# EAGLE design TeensyBalanceBoard2.1 (EAGLE 8.2.0)
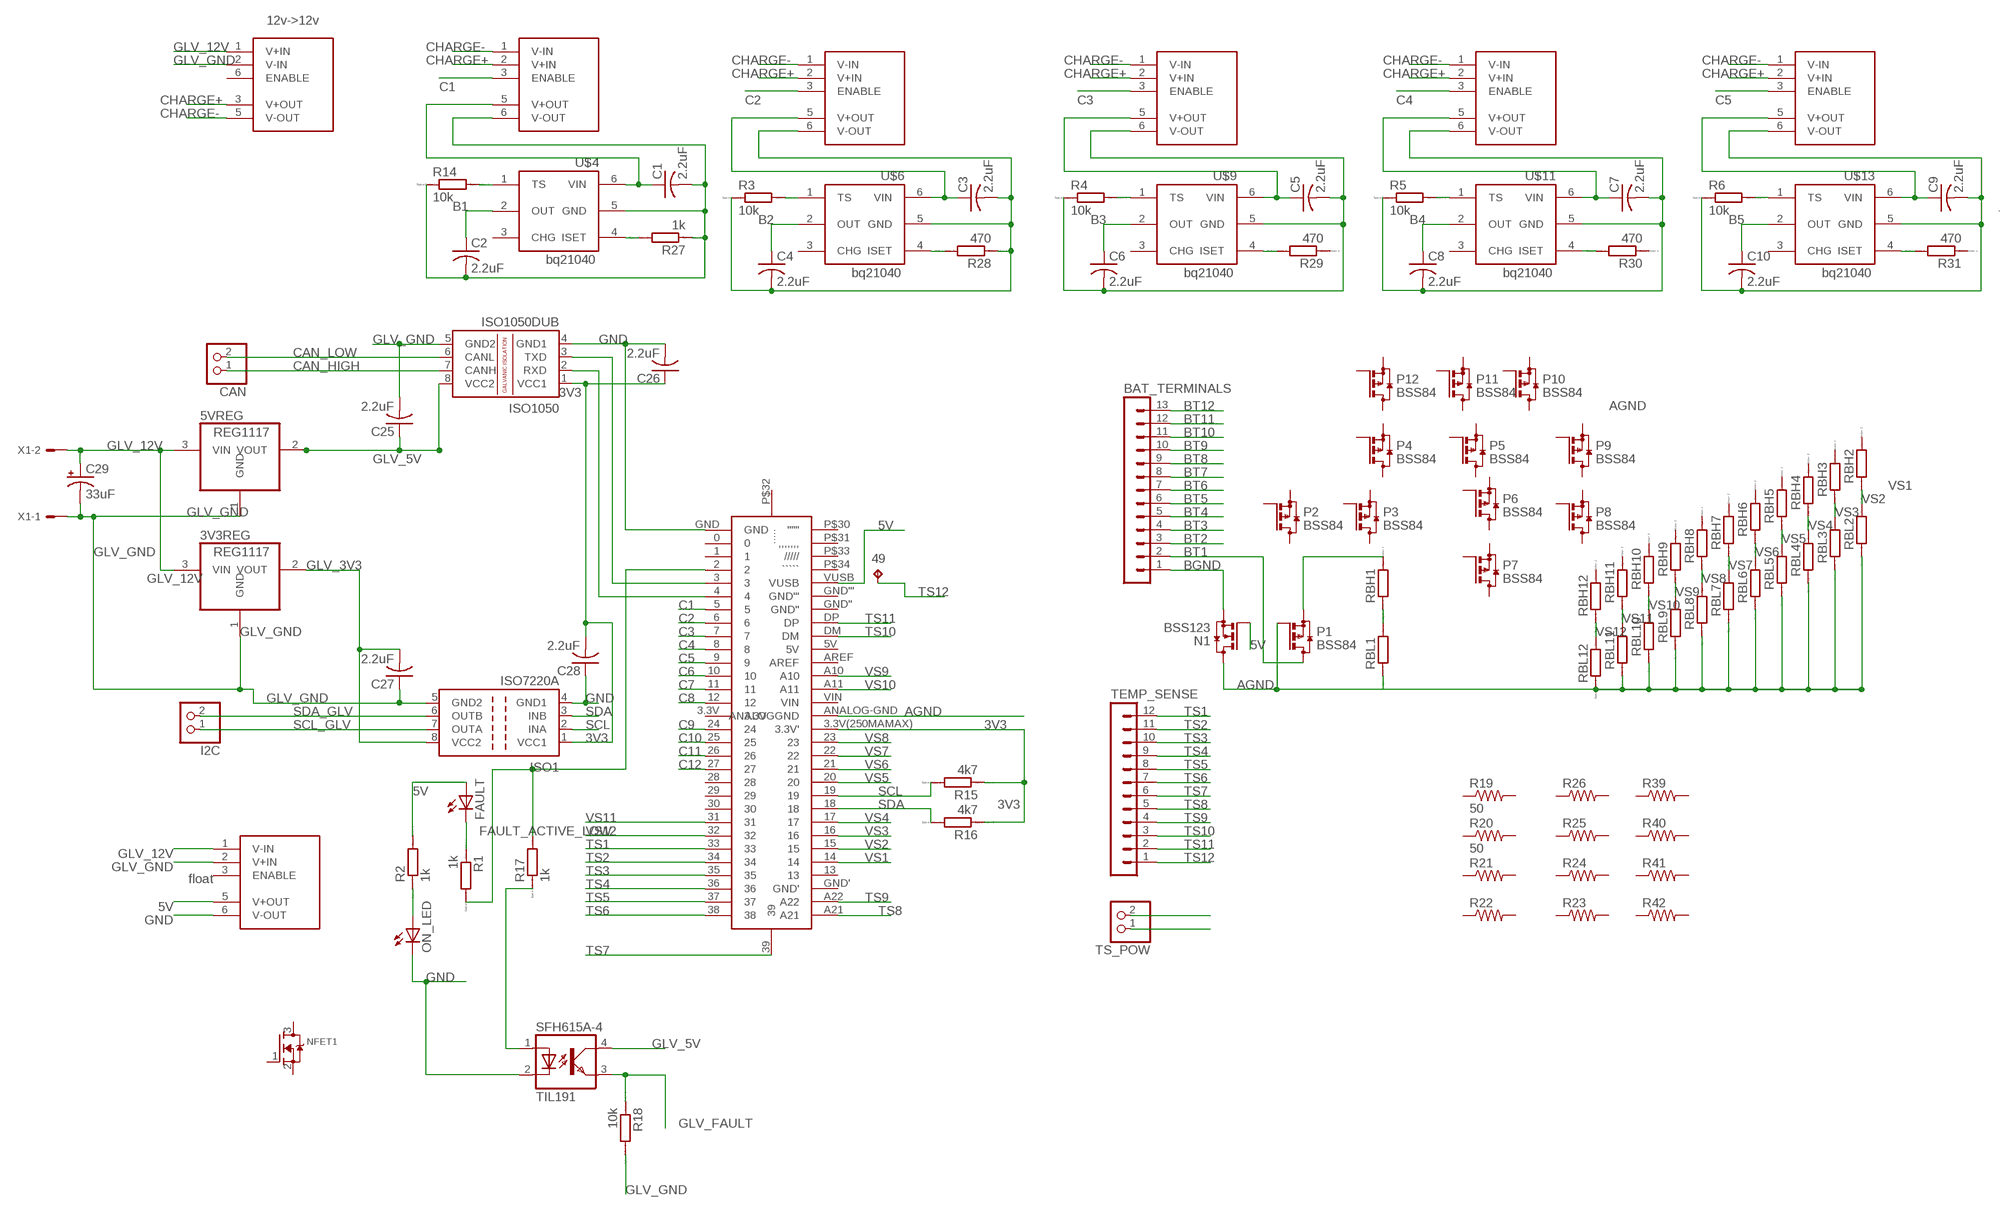
[diagram p0: schematic, sheet 1, part 1 of 2]
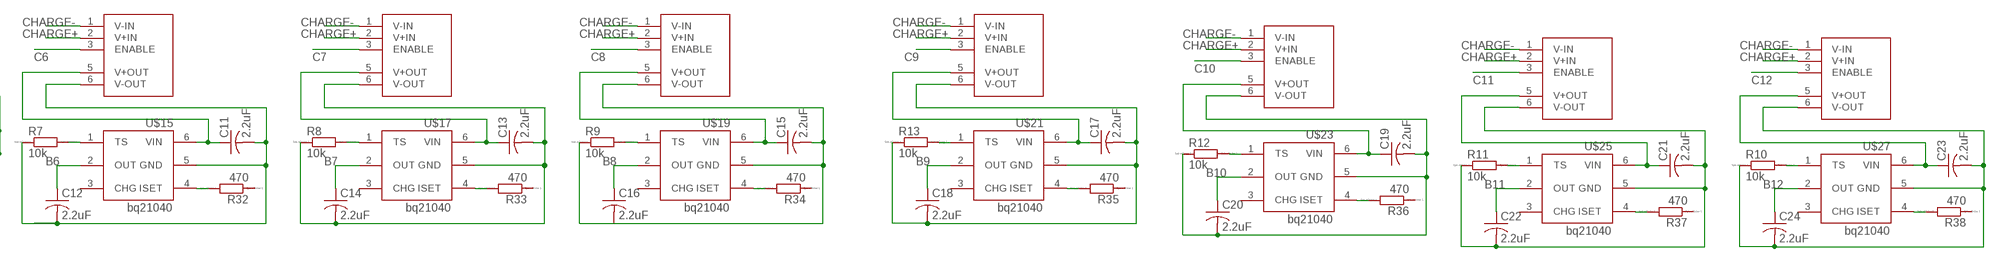
[diagram p1: schematic, sheet 1, part 2 of 2]

## Parts
3V3REG  REG1117  [SOT223]
5VREG  REG1117  [SOT223]
49  TPTP20SQ  [TP20SQ]
BAT_TERMINALS  MA13-1  [MA13-1]
C1  2.2uF  C-USC0603  [C0603]
C2  2.2uF  C-USC0603  [C0603]
C3  2.2uF  C-USC0603  [C0603]
C4  2.2uF  C-USC0603  [C0603]
C5  2.2uF  C-USC0603  [C0603]
C6  2.2uF  C-USC0603  [C0603]
C7  2.2uF  C-USC0603  [C0603]
C8  2.2uF  C-USC0603  [C0603]
C9  2.2uF  C-USC0603  [C0603]
C10  2.2uF  C-USC0603  [C0603]
C11  2.2uF  C-USC0603  [C0603]
C12  2.2uF  C-USC0603  [C0603]
C13  2.2uF  C-USC0603  [C0603]
C14  2.2uF  C-USC0603  [C0603]
C15  2.2uF  C-USC0603  [C0603]
C16  2.2uF  C-USC0603  [C0603]
C17  2.2uF  C-USC0603  [C0603]
C18  2.2uF  C-USC0603  [C0603]
C19  2.2uF  C-USC0603  [C0603]
C20  2.2uF  C-USC0603  [C0603]
C21  2.2uF  C-USC0603  [C0603]
C22  2.2uF  C-USC0603  [C0603]
C23  2.2uF  C-USC0603  [C0603]
C24  2.2uF  C-USC0603  [C0603]
C25  2.2uF  C-USC0603  [C0603]
C26  2.2uF  C-USC0603  [C0603]
C27  2.2uF  C-USC0603  [C0603]
C28  2.2uF  C-USC0603  [C0603]
C29  33uF  CPOL-USE3.5-10  [E3,5-10]
CAN  PINHD-1X2  [1X02]
FAULT  LEDSMT1206  [1206]
I2C  PINHD-1X2  [1X02]
ISO1  ISO7220A  [SO-08]
ISO1050  ISO1050DUB  [DUB-R-PDSO-G8]
N1  BSS123  [SOT23]
NFET1  MOSFET-NREFLOW  [SOT23]
ON_LED  LEDSMT1206  [1206]
P1  BSS84  [SOT23]
P2  BSS84  [SOT23]
P3  BSS84  [SOT23]
P4  BSS84  [SOT23]
P5  BSS84  [SOT23]
P6  BSS84  [SOT23]
P7  BSS84  [SOT23]
P8  BSS84  [SOT23]
P9  BSS84  [SOT23]
P10  BSS84  [SOT23]
P11  BSS84  [SOT23]
P12  BSS84  [SOT23]
R1  1k  RR0603  [R0603]
R2  1k  RR0603  [R0603]
R3  10k  RR0603  [R0603]
R4  10k  RR0603  [R0603]
R5  10k  RR0603  [R0603]
R6  10k  RR0603  [R0603]
R7  10k  RR0603  [R0603]
R8  10k  RR0603  [R0603]
R9  10k  RR0603  [R0603]
R10  10k  RR0603  [R0603]
R11  10k  RR0603  [R0603]
R12  10k  RR0603  [R0603]
R13  10k  RR0603  [R0603]
R14  10k  RR0603  [R0603]
R15  4k7  RR0603  [R0603]
R16  4k7  RR0603  [R0603]
R17  1k  RR0603  [R0603]
R18  10k  RR0603  [R0603]
R19  50  R-US_R1206W  [R1206W]
R20  50  R-US_R1206W  [R1206W]
R21  R-US_R1206W  [R1206W]
R22  R-US_R1206W  [R1206W]
R23  R-US_R1206W  [R1206W]
R24  R-US_R1206W  [R1206W]
R25  R-US_R1206W  [R1206W]
R26  R-US_R1206W  [R1206W]
R27  1k  RR0603  [R0603]
R28  470  RR0603  [R0603]
R29  470  RR0603  [R0603]
R30  470  RR0603  [R0603]
R31  470  RR0603  [R0603]
R32  470  RR0603  [R0603]
R33  470  RR0603  [R0603]
R34  470  RR0603  [R0603]
R35  470  RR0603  [R0603]
R36  470  RR0603  [R0603]
R37  470  RR0603  [R0603]
R38  470  RR0603  [R0603]
R39  R-US_R1206W  [R1206W]
R40  R-US_R1206W  [R1206W]
R41  R-US_R1206W  [R1206W]
R42  R-US_R1206W  [R1206W]
RBH1  RR0603  [R0603]
RBH2  RR0603  [R0603]
RBH3  RR0603  [R0603]
RBH4  RR0603  [R0603]
RBH5  RR0603  [R0603]
RBH6  RR0603  [R0603]
RBH7  RR0603  [R0603]
RBH8  RR0603  [R0603]
RBH9  RR0603  [R0603]
RBH10  RR0603  [R0603]
RBH11  RR0603  [R0603]
RBH12  RR0603  [R0603]
RBL1  RR0603  [R0603]
RBL2  RR0603  [R0603]
RBL3  RR0603  [R0603]
RBL4  RR0603  [R0603]
RBL5  RR0603  [R0603]
RBL6  RR0603  [R0603]
RBL7  RR0603  [R0603]
RBL8  RR0603  [R0603]
RBL9  RR0603  [R0603]
RBL10  RR0603  [R0603]
RBL11  RR0603  [R0603]
RBL12  RR0603  [R0603]
SFH615A-4  TIL191  [DIL04]
TEMP_SENSE  MA12-1  [MA12-1]
TS_POW  PINHD-1X2  [1X02]
U$1  TEENSY3.6  [TEENSY3.6]
U$2  EC4SAW-24S05N6-2411WI  [EC4SAW-24S05N]
U$3  EC4SAW-24S05N6-2411WI  [EC4SAW-24S05N]
U$4  10F200T  [SOT23-6]
U$5  EC4SAW-24S05N6-2411WI  [EC4SAW-24S05N]
U$6  10F200T  [SOT23-6]
U$7  EC4SAW-24S05N6-2411WI  [EC4SAW-24S05N]
U$8  PDQ30-Q24-S12-D  [PDQ30-Q24-S12-D]
U$9  10F200T  [SOT23-6]
U$10  EC4SAW-24S05N6-2411WI  [EC4SAW-24S05N]
U$11  10F200T  [SOT23-6]
U$12  EC4SAW-24S05N6-2411WI  [EC4SAW-24S05N]
U$13  10F200T  [SOT23-6]
U$14  EC4SAW-24S05N6-2411WI  [EC4SAW-24S05N]
U$15  10F200T  [SOT23-6]
U$16  EC4SAW-24S05N6-2411WI  [EC4SAW-24S05N]
U$17  10F200T  [SOT23-6]
U$18  EC4SAW-24S05N6-2411WI  [EC4SAW-24S05N]
U$19  10F200T  [SOT23-6]
U$20  EC4SAW-24S05N6-2411WI  [EC4SAW-24S05N]
U$21  10F200T  [SOT23-6]
U$22  EC4SAW-24S05N6-2411WI  [EC4SAW-24S05N]
U$23  10F200T  [SOT23-6]
U$24  EC4SAW-24S05N6-2411WI  [EC4SAW-24S05N]
U$25  10F200T  [SOT23-6]
U$26  EC4SAW-24S05N6-2411WI  [EC4SAW-24S05N]
U$27  10F200T  [SOT23-6]
X1  KK-156-2  [KK-156-2]

## Nets
3V3: C26.1 C28.2 ISO1.1(VCC1) ISO1050.1(VCC1) R15.1 R16.1 TS_POW.2 U$1.3.3V(250MAMAX)(3.3V')
5V [5vPower]: FAULT.A N1.1(G) R2.2 U$1.VUSB U$3.5(V+OUT)
AGND [5vPower]: C1.2 C2.2 N1.3(D) P1.1(G) R14.1 R27.1 RBL1.1 RBL2.1 RBL3.1 RBL4.1 RBL5.1 RBL6.1 RBL7.1 RBL8.1 RBL9.1 RBL10.1 RBL11.1 RBL12.1 TS_POW.1 U$1.ANALOG-GND(ANALOGGND) U$2.6(V-OUT) U$4.5(GND)
B1 [5vPower]: C2.1 C3.2 C4.2 R3.1 R28.1 U$4.2(OUT) U$5.6(V-OUT) U$6.5(GND)
B2 [5vPower]: C4.1 C5.2 C6.2 R4.1 U$6.2(OUT) U$7.6(V-OUT) U$9.5(GND)
B3 [5vPower]: C6.1 C7.2 C8.2 R5.1 U$9.2(OUT) U$10.6(V-OUT) U$11.5(GND)
B4 [5vPower]: C8.1 C9.2 C10.2 R6.1 U$11.2(OUT) U$12.6(V-OUT) U$13.5(GND)
B5 [5vPower]: C10.1 C11.2 C12.2 R7.1 U$13.2(OUT) U$14.6(V-OUT) U$15.5(GND)
B6 [5vPower]: C12.1 C13.2 C14.2 R8.1 U$15.2(OUT) U$16.6(V-OUT) U$17.5(GND)
B7 [5vPower]: C14.1 C15.2 C16.2 R9.1 U$17.2(OUT) U$18.6(V-OUT) U$19.5(GND)
B8 [5vPower]: C16.1 C17.2 C18.2 R13.1 U$19.2(OUT) U$20.6(V-OUT) U$21.5(GND)
B9 [5vPower]: C18.1 C19.2 C20.2 R12.1 U$21.2(OUT) U$22.6(V-OUT) U$23.5(GND)
B10 [5vPower]: C20.1 C21.2 C22.2 R11.1 U$23.2(OUT) U$24.6(V-OUT) U$25.5(GND)
B11 [5vPower]: C22.1 C23.2 C24.2 R10.1 U$25.2(OUT) U$26.6(V-OUT) U$27.5(GND)
B12 [5vPower]: C24.1 U$27.2(OUT)
BGND: BAT_TERMINALS.1 N1.2(S)
BT1: BAT_TERMINALS.2 P1.3(D)
BT2: BAT_TERMINALS.3
BT3: BAT_TERMINALS.4
BT4: BAT_TERMINALS.5
BT5: BAT_TERMINALS.6
BT6: BAT_TERMINALS.7
BT7: BAT_TERMINALS.8
BT8: BAT_TERMINALS.9
BT9: BAT_TERMINALS.10
BT10: BAT_TERMINALS.11
BT11: BAT_TERMINALS.12
BT12: BAT_TERMINALS.13
C1: U$1.5 U$2.3(ENABLE)
C2: U$1.6 U$5.3(ENABLE)
C3: U$1.7 U$7.3(ENABLE)
C4: U$1.8 U$10.3(ENABLE)
C5: U$1.9 U$12.3(ENABLE)
C6: U$1.10 U$14.3(ENABLE)
C7: U$1.11 U$16.3(ENABLE)
C8: U$1.12 U$18.3(ENABLE)
C9: U$1.24 U$20.3(ENABLE)
C10: U$1.25 U$22.3(ENABLE)
C11: U$1.26 U$24.3(ENABLE)
C12: U$1.27 U$26.3(ENABLE)
CAN_HIGH: CAN.1 ISO1050.7(CANH)
CAN_LOW: CAN.2 ISO1050.6(CANL)
CHARGE+ [12vPower]: U$2.2(V+IN) U$5.2(V+IN) U$7.2(V+IN) U$8.3(V+OUT) U$10.2(V+IN) U$12.2(V+IN) U$14.2(V+IN) U$16.2(V+IN) U$18.2(V+IN) U$20.2(V+IN) U$22.2(V+IN) U$24.2(V+IN) U$26.2(V+IN)
CHARGE- [12vPower]: U$2.1(V-IN) U$5.1(V-IN) U$7.1(V-IN) U$8.5(V-OUT) U$10.1(V-IN) U$12.1(V-IN) U$14.1(V-IN) U$16.1(V-IN) U$18.1(V-IN) U$20.1(V-IN) U$22.1(V-IN) U$24.1(V-IN) U$26.1(V-IN)
FAULT_ACTIVE_LOW: R1.2 R17.2 U$1.2
GLV_3V3: C27.2 ISO1.8(VCC2)
GLV_5V: 5VREG.2(VOUT) C25.1 ISO1050.8(VCC2) SFH615A-4.4(COL)
GLV_12V [12vPower]: 3V3REG.3(VIN) 5VREG.3(VIN) C29.+ U$3.1(V-IN) U$8.1(V+IN) X1.2
GLV_FAULT: R18.1 SFH615A-4.3(EMIT)
GLV_GND [12vPower]: 3V3REG.1(GND) 5VREG.1(GND) C25.2 C27.1 C29.- ISO1050.5(GND2) U$3.2(V+IN) U$8.2(V-IN) X1.1
GND [12vPower]: C26.2 C28.1 ISO1050.4(GND1) ON_LED.C SFH615A-4.2(C) U$1.GND U$3.6(V-OUT)
N$1 [5vPower]: C1.1 U$2.5(V+OUT) U$4.6(VIN)
N$2: R17.1 SFH615A-4.1(A)
N$3: ISO1050.3(TXD) U$1.3
N$4: ISO1050.2(RXD) U$1.4
N$5 [5vPower]: C3.1 U$5.5(V+OUT) U$6.6(VIN)
N$6: ON_LED.A R2.1
N$7: FAULT.C R1.1
N$8: R27.2 U$4.4(ISET)
N$9: R28.2 U$6.4(ISET)
N$10 [5vPower]: C5.1 U$7.5(V+OUT) U$9.6(VIN)
N$11: R29.2 U$9.4(ISET)
N$12 [5vPower]: C7.1 U$10.5(V+OUT) U$11.6(VIN)
N$13: R30.2 U$11.4(ISET)
N$14 [5vPower]: C9.1 U$12.5(V+OUT) U$13.6(VIN)
N$15: R31.2 U$13.4(ISET)
N$16 [5vPower]: C11.1 U$14.5(V+OUT) U$15.6(VIN)
N$17: R32.2 U$15.4(ISET)
N$18 [5vPower]: C13.1 U$16.5(V+OUT) U$17.6(VIN)
N$19: R33.2 U$17.4(ISET)
N$20 [5vPower]: C15.1 U$18.5(V+OUT) U$19.6(VIN)
N$21: R34.2 U$19.4(ISET)
N$22 [5vPower]: C17.1 U$20.5(V+OUT) U$21.6(VIN)
N$23: R35.2 U$21.4(ISET)
N$24 [5vPower]: C19.1 U$22.5(V+OUT) U$23.6(VIN)
N$25: R36.2 U$23.4(ISET)
N$26 [5vPower]: C21.1 U$24.5(V+OUT) U$25.6(VIN)
N$27: R37.2 U$25.4(ISET)
N$28 [5vPower]: C23.1 U$26.5(V+OUT) U$27.6(VIN)
N$29: R38.2 U$27.4(ISET)
N$30: R3.2 U$6.1(TS)
N$31: R13.2 U$21.1(TS)
N$32: R12.2 U$23.1(TS)
N$33: R11.2 U$25.1(TS)
N$34: R10.2 U$27.1(TS)
N$35: R9.2 U$19.1(TS)
N$36: R8.2 U$17.1(TS)
N$37: R7.2 U$15.1(TS)
N$38: R6.2 U$13.1(TS)
N$39: R5.2 U$11.1(TS)
N$40: R4.2 U$9.1(TS)
N$41: R14.2 U$4.1(TS)
N$47: P1.2(S) RBH1.2
SCL: ISO1.2(INA) R15.2 U$1.19
SCL_GLV: I2C.1 ISO1.7(OUTA)
SDA: ISO1.3(INB) R16.2 U$1.18
SDA_GLV: I2C.2 ISO1.6(OUTB)
TS1: TEMP_SENSE.12 U$1.33
TS2: TEMP_SENSE.11 U$1.34
TS3: TEMP_SENSE.10 U$1.35
TS4: TEMP_SENSE.9 U$1.36
TS5: TEMP_SENSE.8 U$1.37
TS6: TEMP_SENSE.7 U$1.38
TS7: TEMP_SENSE.6 U$1.39
TS8: TEMP_SENSE.5 U$1.A21
TS9: TEMP_SENSE.4 U$1.A22
TS10: TEMP_SENSE.3 U$1.DM
TS11: TEMP_SENSE.2 U$1.DP
TS12: 49.TP TEMP_SENSE.1
VS1: RBH1.1 RBL1.2 U$1.14
VS2: RBH2.1 RBL2.2 U$1.15
VS3: RBH3.1 RBL3.2 U$1.16
VS4: RBH4.1 RBL4.2 U$1.17
VS5: RBH5.1 RBL5.2 U$1.20
VS6: RBH6.1 RBL6.2 U$1.21
VS7: RBH7.1 RBL7.2 U$1.22
VS8: RBH8.1 RBL8.2 U$1.23
VS9: RBH9.1 RBL9.2 U$1.A10
VS10: RBH10.1 RBL10.2 U$1.A11
VS11: RBH11.1 RBL11.2 U$1.31
VS12: RBH12.1 RBL12.2 U$1.32
Unconnected: 3V3REG.2(VOUT) NFET1.1(G) NFET1.2(S) NFET1.3(D) P2.1(G) P2.2(S) P2.3(D) P3.1(G) P3.2(S) P3.3(D) P4.1(G) P4.2(S) P4.3(D) P5.1(G) P5.2(S) P5.3(D) P6.1(G) P6.2(S) P6.3(D) P7.1(G) P7.2(S) P7.3(D) P8.1(G) P8.2(S) P8.3(D) P9.1(G) P9.2(S) P9.3(D) P10.1(G) P10.2(S) P10.3(D) P11.1(G) P11.2(S) P11.3(D) P12.1(G) P12.2(S) P12.3(D) R18.2 R19.1 R19.2 R20.1 R20.2 R21.1 R21.2 R22.1 R22.2 R23.1 R23.2 R24.1 R24.2 R25.1 R25.2 R26.1 R26.2 R29.1 R30.1 R31.1 R32.1 R33.1 R34.1 R35.1 R36.1 R37.1 R38.1 R39.1 R39.2 R40.1 R40.2 R41.1 R41.2 R42.1 R42.2 RBH2.2 RBH3.2 RBH4.2 RBH5.2 RBH6.2 RBH7.2 RBH8.2 RBH9.2 RBH10.2 RBH11.2 RBH12.2 U$1.0 U$1.1 U$1.3.3V U$1.5V U$1.13 U$1.28 U$1.29 U$1.30 U$1.AREF U$1.GND' U$1.GND'' U$1.GND''' U$1.P$30('''''') U$1.P$31(,,,,,,,) U$1.P$32(.....) U$1.P$33(/////) U$1.P$34(`````) U$1.VIN U$3.3(ENABLE) U$4.3(CHG) U$6.3(CHG) U$8.6(ENABLE) U$9.3(CHG) U$11.3(CHG) U$13.3(CHG) U$15.3(CHG) U$17.3(CHG) U$19.3(CHG) U$21.3(CHG) U$23.3(CHG) U$25.3(CHG) U$27.3(CHG)

## Notes on the sheet
- 12v->12v
- float

## Power pins joined to a net without a drawn wire
GND1: ISO1.4(GND1)
GND2: ISO1.5(GND2)

## Library data of the parts
3V3REG 5VREG = burr-brown:REG1117: 800mA and 1A Low Dropout (LDO) Positive Regulator 1.8V, 2.5V, 2.85V, 3.3V, 5V, and Adj; MPN: REG1117; OC_FARNELL: 1097566; OC_NEWARK: 14P6981
49 = testpad:TP: Test pad
BAT_TERMINALS = con-lstb:MA13-1: PIN HEADER; OC_FARNELL: unknown; OC_NEWARK: unknown
C1-C28 = adafruit:C-US: CAPACITOR, American symbol
C29 = adafruit:CPOL-US: POLARIZED CAPACITOR, American symbol
CAN I2C TS_POW = pinhead:PINHD-1X2: PIN HEADER
FAULT ON_LED = led:LED: LED OSRAM: - CHIPLED LG R971, LG N971, LY N971, LG Q971, LY Q971, LO R971, LY R971 LH N974, LH R974 LS Q976, LO Q976, LY Q976 LO Q996 - Hyper CHIPLED LW Q18S LB Q993, LB Q99A, LB R99A - SideLED LS A670, LO A670, LY A670, LG A670, LP A670 LB A673, LV A673, LT A673, LW A673 LH A674 LY A675 LS A676, LA A676, LO A676, LY A676, LW A676 LS A679, LY A679, LG A679 - Hyper Micro SIDELED® LS Y876, LA Y876, LO Y876, LY Y876 LT Y87S - SmartLED LW L88C, LW L88S LB L89C, LB L89S, LG L890 LS L89K, LO L89K, LY L89K LS L896, LA L896, LO L896, LY L896 - TOPLED LS T670, LO T670, LY T670, LG T670, LP T670 LSG T670, LSP T670, LSY T670, LOP T670, LYG T670 LG T671, LOG T671, LSG T671 LB T673, LV T673, LT T673, LW T673 LH T674 LS T676, LA T676, LO T676, LY T676, LB T676, LH T676, LSB T676, LW T676 LB T67C, LV T67C, LT T67C, LS T67K, LO T67K, LY T67K, LW E67C LS E67B, LA E67B, LO E67B, LY E67B, LB E67C, LV E67C, LT E67C LW T67C LS T679, LY T679, LG T679 LS T770, LO T770, LY T770, LG T770, LP T770 LB T773, LV T773, LT T773, LW T773 LH T774 LS E675, LA E675, LY E675, LS T675 LS T776, LA T776, LO T776, LY T776, LB T776 LHGB T686 LT T68C, LB T68C - Hyper Mini TOPLED® LB M676 - Mini TOPLED Santana® LG M470 LS M47K, LO M47K, LY M47K Source: http://www.osram.convergy.de LUXEON: - LUMILED® LXK2-PW12-R00, LXK2-PW12-S00, LXK2-PW14-U00, LXK2-PW14-V00 LXK2-PM12-R00, LXK2-PM12-S00, LXK2-PM14-U00 LXK2-PE12-Q00, LXK2-PE12-R00, LXK2-PE12-S00, LXK2-PE14-T00, LXK2-PE14-U00 LXK2-PB12-K00, LXK2-PB12-L00, LXK2-PB12-M00, LXK2-PB14-N00, LXK2-PB14-P00, LXK2-PB14-Q00 LXK2-PR12-L00, LXK2-PR12-M00, LXK2-PR14-Q00, LXK2-PR14-R00 LXK2-PD12-Q00, LXK2-PD12-R00, LXK2-PD12-S00 LXK2-PH12-R00, LXK2-PH12-S00 LXK2-PL12-P00, LXK2-PL12-Q00, LXK2-PL12-R00 Source: www.luxeon.com KINGBRIGHT: KA-3528ASYC Source: www.kingbright.com
ISO1 = texas:ISO7220: DUAL DIGITAL ISOLATORS Source: http://focus.ti.com/lit/ds/symlink/iso7221a.pdf; MPN: ISO7220AD; OC_FARNELL: 1390649; OC_NEWARK: 48M0666
ISO1050 = texas:ISO1050: ISOLATED CAN TRANSCEIVER Source: http://focus.ti.com/lit/ds/symlink/iso1050.pdf; MPN: ISO1050DUBR; OC_FARNELL: 1755712; OC_NEWARK: 14R9899
N1 = transistor-small-signal:BSS123: N-CHANNEL MOS FET
NFET1 = adafruit:MOSFET-N: N-Channel Mosfet 2N7002E - 60V 260mA SOT23 [Digikey: 2N7002ET1GOSTR-ND] - REEL BSH103 - 30V 850mA SOT23 [Digikey: 568-5013-1-ND]
P1-P12 = transistor-small-signal:BSS84: P-CHANNEL MOS FET
R1-R18 R27-R38 RBH1-RBH12 RBL1-RBL12 = eagle-ltspice:R: RESISTOR, European symbol; SPICEMODEL: NONE; SPICEPREFIX: R
R19-R26 R39-R42 = adafruit:R-US_: RESISTOR, American symbol
SFH615A-4 = optocoupler:TIL191: TEXAS INSTRUMENTS OPTO COUPLER; OC_FARNELL: 1683363; OC_NEWARK: unknown
TEMP_SENSE = con-lstb:MA12-1: PIN HEADER; OC_FARNELL: unknown; OC_NEWARK: unknown
U$1 = Teensy36:TEENSY3.6
U$2 U$3 U$5 U$7 U$10 U$12 U$14 U$16 U$18 U$20 U$22 U$24 U$26 = Teensy36:EC4SAW-24S05N
U$4 U$6 U$9 U$11 U$13 U$15 U$17 U$19 U$21 U$23 U$25 U$27 = adafruit:10F200T: PIC10F200/202/204/206 Ultra-small 8-bit PIC micros in SOT-23-6 and SOIC
U$8 = Teensy36:PDQ30-Q24-S12-D
X1 = con-molex:KK-156-2: KK 156 HEADER Source: http://www.molex.com/pdm_docs/sd/026604100_sd.pdf; OC_FARNELL: unknown; OC_NEWARK: unknown

## Net classes
0 default: width 0.203 mm
1 12vPower: width 1.016 mm
2 5vPower: width 0.508 mm

## Board
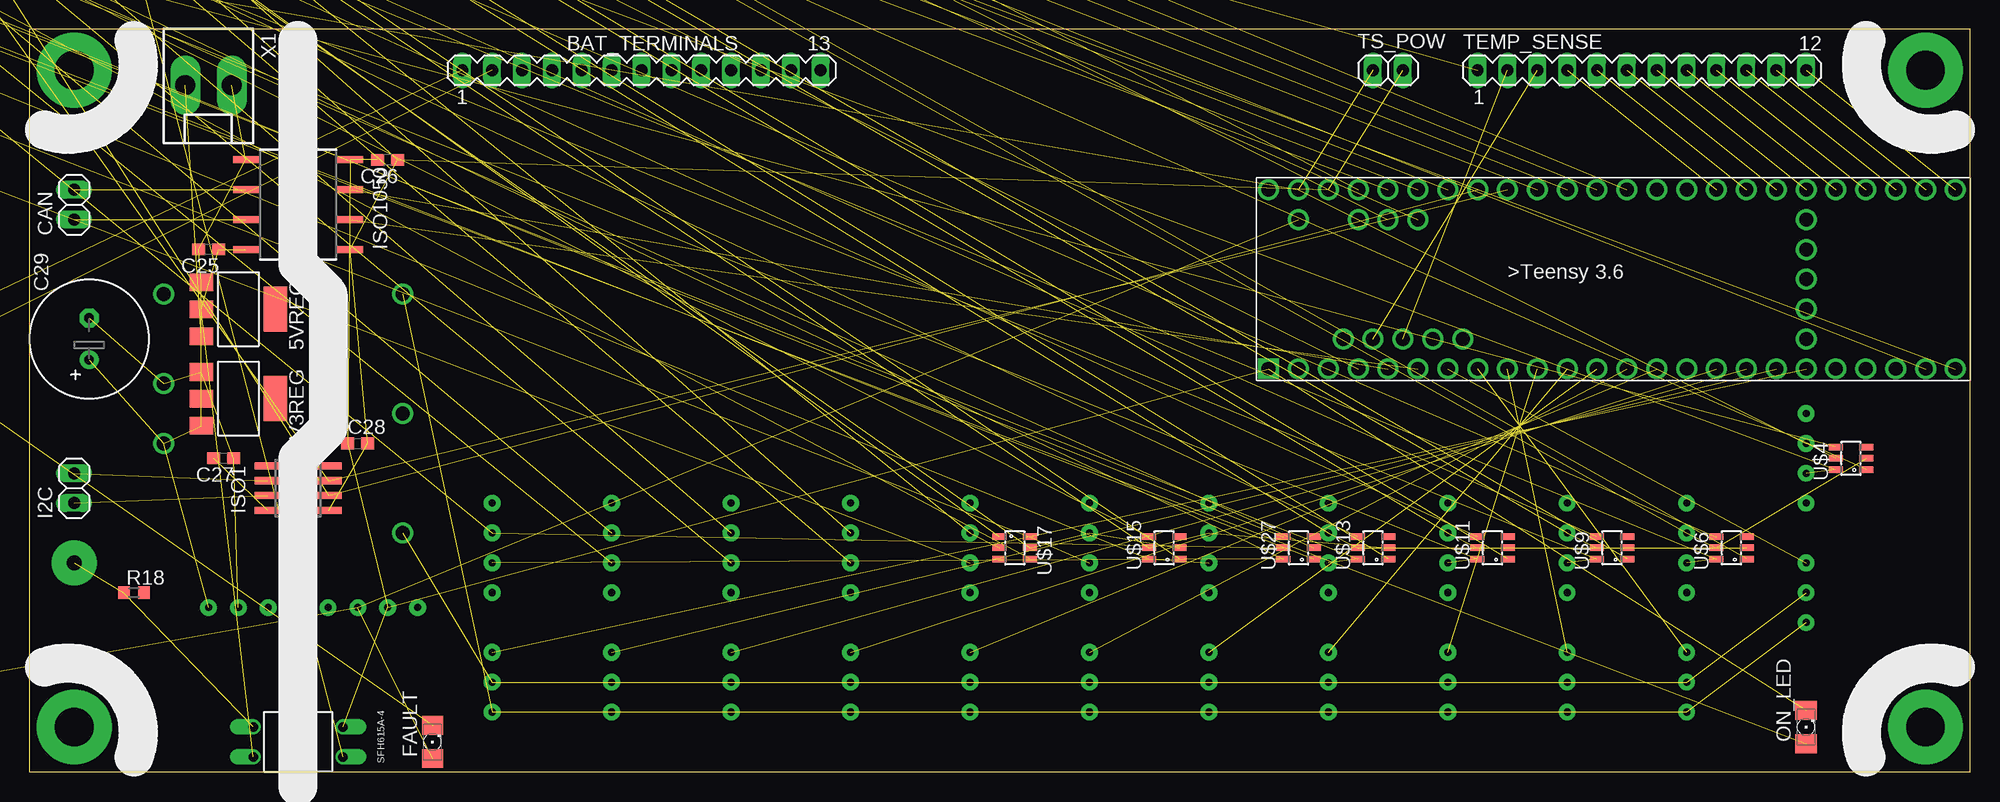
[diagram p2: board, top side]
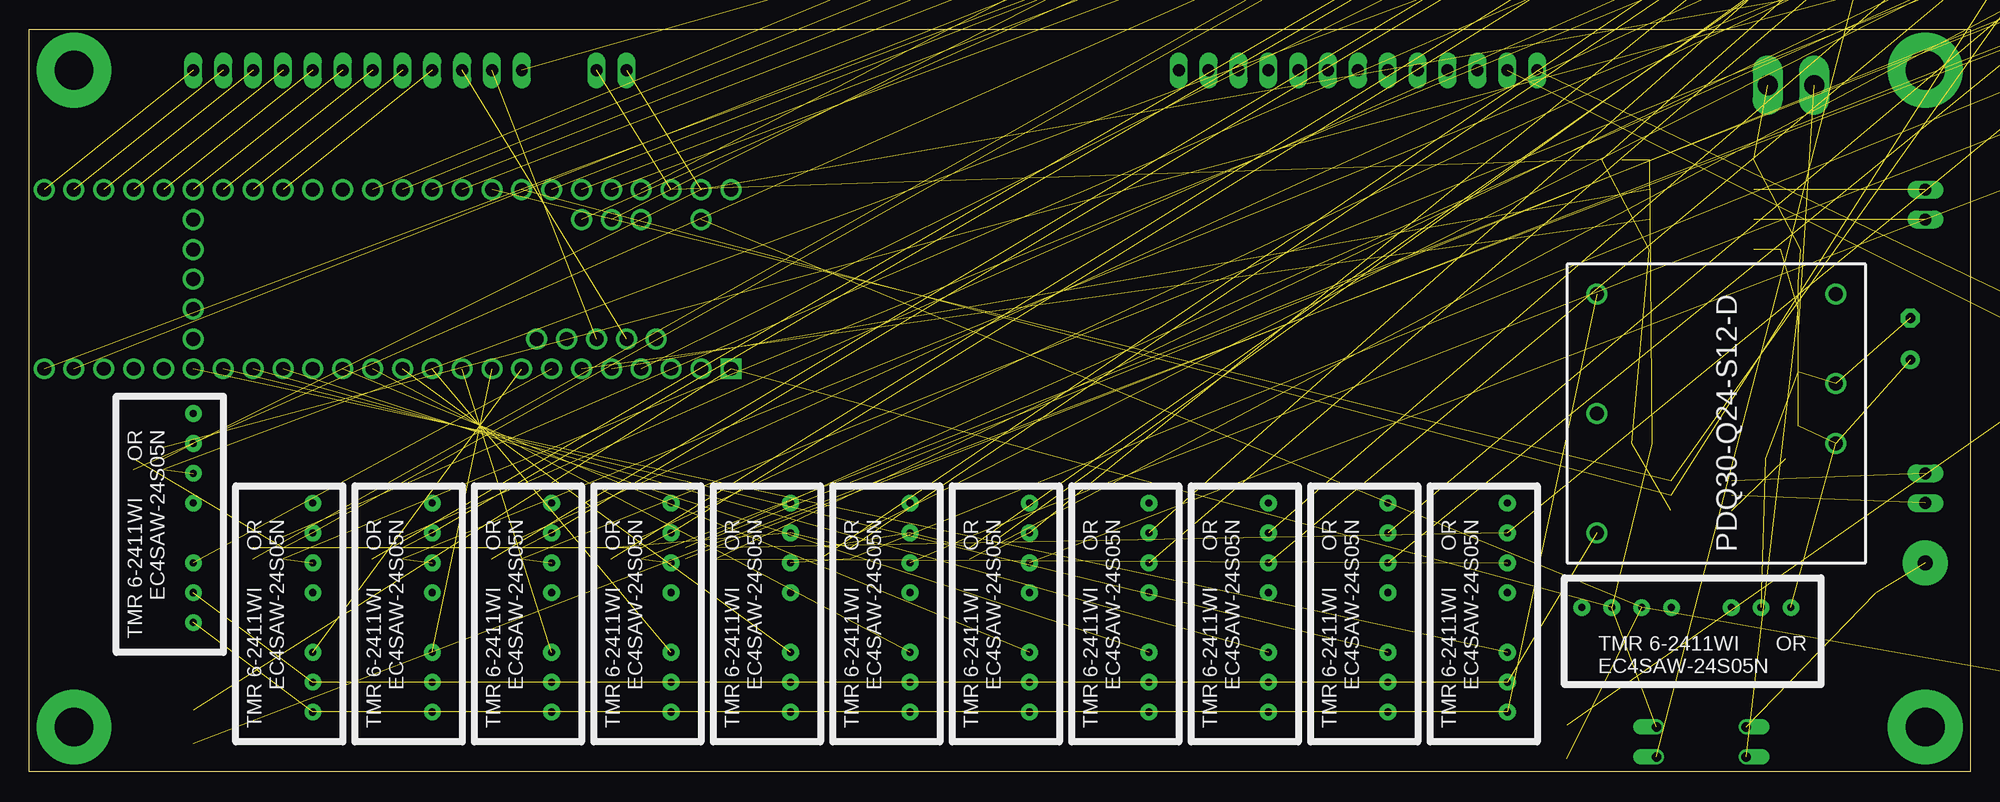
[diagram p3: board, bottom side, seen from below]

Size 165.08 x 63.17 mm. Coordinates in mm from the lower left corner, seen from the top.
Outline: 0,0 165.08,0 165.08,63.17 0,63.17 0,0
Copper layers (1*16): Top 0.035mm / dielectric 1.5mm / Bottom 0.035mm
Design rules "default": minimum track width 6mil, minimum drill 0.35mm, track to track 6mil, track to pad 6mil, pad to pad 6mil, via to via 6mil, smd to smd 6mil, copper to edge 40mil, drill to drill 6mil, minimum pad ring 10mil, minimum via ring 8mil, stop-mask expansion 4mil, vias tented up to drill 0mil, thermal gap 10mil

### Footprints (pad centres in the part's own frame; a part is rotated, then mirrored left to right if it is on the bottom)
SOT223 = smd 1.499 x 2.007: 1 -2.261,-3.15; 2 0.025,-3.15; 3 2.311,-3.15 | smd 3.81 x 2.007: 4 0,3.15
TP20SQ = smd 2 x 2: TP 0,0
MA13-1 = drill 1.016 long: 1 -15.24,0; 2 -12.7,0; 3 -10.16,0; 4 -7.62,0; 5 -5.08,0; 6 -2.54,0; 7 0,0; 8 2.54,0; 9 5.08,0; 10 7.62,0; 11 10.16,0; 12 12.7,0; 13 15.24,0
C0603 = smd 1.1 x 1: 1 -0.85,0; 2 0.85,0
E3,5-10 = drill 0.813 pad 1.6: + -1.778,0 | drill 0.813 pad 1.6 octagon: - 1.778,0
1X02 = drill 1.016 long: 1 -1.27,0; 2 1.27,0
1206 = smd 1.6 x 1.803: A -1.422,0; C 1.422,0
SO-08 = smd 0.6 x 2.2: 1 -1.905,-2.6; 2 -0.635,-2.6; 3 0.635,-2.6; 4 1.905,-2.6; 5 1.905,2.6; 6 0.635,2.6; 7 -0.635,2.6; 8 -1.905,2.6
DUB-R-PDSO-G8 = smd 0.6 x 2.2: 1 -3.81,-4.445; 2 -1.27,-4.445; 3 1.27,-4.445; 4 3.81,-4.445; 5 3.81,4.445; 6 1.27,4.445; 7 -1.27,4.445; 8 -3.81,4.445
SOT23 = smd 1 x 1.4: 1 -0.95,-1.1; 2 0.95,-1.1; 3 0,1.1
R0603 = smd 1 x 1.1: 1 -0.85,0; 2 0.85,0
R1206W = smd 1.8 x 1.2: 1 -1.499,0; 2 1.499,0
DIL04 = drill 0.813 offset: 1 -1.27,-3.81; 2 1.27,-3.81; 3 1.27,3.81; 4 -1.27,3.81
MA12-1 = drill 1.016 long: 1 -13.97,0; 2 -11.43,0; 3 -8.89,0; 4 -6.35,0; 5 -3.81,0; 6 -1.27,0; 7 1.27,0; 8 3.81,0; 9 6.35,0; 10 8.89,0; 11 11.43,0; 12 13.97,0
TEENSY3.6 = drill 1.19: 0 2.54,-15.24; 1 5.08,-15.24; 2 7.62,-15.24; 3 10.16,-15.24; 3.3V 35.56,-15.24; 3.3V(250MAMAX) 5.08,0; 4 12.7,-15.24; 5 15.24,-15.24; 5V 6.35,-12.7; 6 17.78,-15.24; 7 20.32,-15.24; 8 22.86,-15.24; 9 25.4,-15.24; 10 27.94,-15.24; 11 30.48,-15.24; 12 33.02,-15.24; 13 33.02,0; 14 30.48,0; 15 27.94,0; 16 25.4,0; 17 22.86,0; 18 20.32,0; 19 17.78,0; 20 15.24,0; 21 12.7,0; 22 10.16,0; 23 7.62,0; 24 38.1,-15.24; 25 40.64,-15.24; 26 43.18,-15.24; 27 45.72,-15.24; 28 48.26,-15.24; 29 50.8,-15.24; 30 53.34,-15.24; 31 55.88,-15.24; 32 58.42,-15.24; 33 58.42,0; 34 55.88,0; 35 53.34,0; 36 50.8,0; 37 48.26,0; 38 45.72,0; 39 43.18,0; A10 10.16,-2.54; A11 12.7,-2.54; A21 40.64,0; A22 38.1,0; ANALOG-GND 2.54,0; AREF 7.62,-2.54; DM 8.89,-12.7; DP 11.43,-12.7; GND' 35.56,0; GND'' 13.97,-12.7; GND''' 16.51,-12.7; P$30 45.72,-12.7; P$31 45.72,-10.16; P$32 45.72,-7.62; P$33 45.72,-5.08; P$34 45.72,-2.54; VIN 0,0; VUSB 2.54,-2.54 | drill 1.19 square: GND 0,-15.24
EC4SAW-24S05N = drill 0.6 pad 1.422: 1 2.54,2.54; 2 5.08,2.54; 3 7.62,2.54; 4 12.7,2.54; 5 15.24,2.54; 6 17.78,2.54; 7 20.32,2.54
SOT23-6 = smd 0.55 x 1.2: 1 -0.95,-1.3; 2 0,-1.3; 3 0.95,-1.3; 4 0.95,1.3; 5 0,1.3; 6 -0.95,1.3
PDQ30-Q24-S12-D = drill 1.19: 1 15.24,22.86; 2 10.16,22.86; 3 22.86,2.54; 4 12.7,2.54; 5 2.54,2.54; 6 2.54,22.86
KK-156-2 = drill 1.7 pad 2.184 long: 1 -1.98,0; 2 1.98,0

### Placement (x,y rotation side)
3V3REG  17.78,31.75 270 top
5VREG  17.78,39.37 270 top
49  -50.8,109.22 0 top  (outside the outline)
BAT_TERMINALS  52.07,59.69 0 top
C1  -24.13,92.71 0 top  (outside the outline)
C2  -30.48,92.71 0 top  (outside the outline)
C3  -36.83,92.71 0 top  (outside the outline)
C4  -43.18,92.71 0 top  (outside the outline)
C5  -49.53,92.71 0 top  (outside the outline)
C6  -55.88,92.71 0 top  (outside the outline)
C7  -62.23,92.71 0 top  (outside the outline)
C8  -68.58,92.71 0 top  (outside the outline)
C9  -74.93,92.71 0 top  (outside the outline)
C10  -81.28,92.71 0 top  (outside the outline)
C11  -87.63,92.71 0 top  (outside the outline)
C12  -93.98,92.71 0 top  (outside the outline)
C13  -100.33,92.71 0 top  (outside the outline)
C14  -106.68,92.71 0 top  (outside the outline)
C15  -113.03,92.71 0 top  (outside the outline)
C16  -17.78,99.06 0 top  (outside the outline)
C17  -24.13,99.06 0 top  (outside the outline)
C18  -30.48,99.06 0 top  (outside the outline)
C19  -36.83,99.06 0 top  (outside the outline)
C20  -43.18,99.06 0 top  (outside the outline)
C21  -49.53,99.06 0 top  (outside the outline)
C22  -55.88,99.06 0 top  (outside the outline)
C23  -62.23,99.06 0 top  (outside the outline)
C24  -68.58,99.06 0 top  (outside the outline)
C25  15.24,44.45 180 top
C26  30.48,52.07 180 top
C27  16.51,26.67 180 top
C28  27.94,27.94 0 top
C29  5.08,36.83 90 top
CAN  3.81,48.26 90 top
FAULT  34.29,2.54 90 top
I2C  3.81,24.13 90 top
ISO1  22.86,24.13 90 top
ISO1050  22.86,48.26 90 top
N1  -113.03,-10.16 0 top  (outside the outline)
NFET1  -101.6,69.85 0 top  (outside the outline)
ON_LED  151.13,3.81 90 top
P1  -113.03,-17.78 0 top  (outside the outline)
P2  -113.03,-25.4 0 top  (outside the outline)
P3  -113.03,-33.02 0 top  (outside the outline)
P4  -113.03,-40.64 0 top  (outside the outline)
P5  -113.03,-48.26 0 top  (outside the outline)
P6  -113.03,-55.88 0 top  (outside the outline)
P7  -113.03,-63.5 0 top  (outside the outline)
P8  -113.03,-71.12 0 top  (outside the outline)
P9  -113.03,-78.74 0 top  (outside the outline)
P10  -113.03,-86.36 0 top  (outside the outline)
P11  -113.03,-93.98 0 top  (outside the outline)
P12  -113.03,-101.6 0 top  (outside the outline)
R1  -107.95,104.14 0 top  (outside the outline)
R2  -113.03,104.14 0 top  (outside the outline)
R3  -16.51,109.22 0 top  (outside the outline)
R4  -21.59,109.22 0 top  (outside the outline)
R5  -26.67,109.22 0 top  (outside the outline)
R6  -31.75,109.22 0 top  (outside the outline)
R7  -36.83,109.22 0 top  (outside the outline)
R8  -41.91,109.22 0 top  (outside the outline)
R9  -46.99,109.22 0 top  (outside the outline)
R10  -99.06,99.06 0 top  (outside the outline)
R11  -104.14,99.06 0 top  (outside the outline)
R12  -109.22,99.06 0 top  (outside the outline)
R13  -16.51,104.14 0 top  (outside the outline)
R14  -21.59,104.14 0 top  (outside the outline)
R15  -26.67,104.14 0 top  (outside the outline)
R16  -31.75,104.14 0 top  (outside the outline)
R17  5.08,87.63 0 top  (outside the outline)
R18  8.89,15.24 0 top
R19  -69.85,107.95 0 top  (outside the outline)
R20  -64.77,107.95 0 top  (outside the outline)
R21  -74.93,107.95 0 top  (outside the outline)
R22  -80.01,107.95 0 top  (outside the outline)
R23  -85.09,107.95 0 top  (outside the outline)
R24  -90.17,107.95 0 top  (outside the outline)
R25  -95.25,107.95 0 top  (outside the outline)
R26  -100.33,107.95 0 top  (outside the outline)
R27  0,68.58 0 top  (outside the outline)
R28  -52.07,104.14 0 top  (outside the outline)
R29  -57.15,104.14 0 top  (outside the outline)
R30  -62.23,104.14 0 top  (outside the outline)
R31  -67.31,104.14 0 top  (outside the outline)
R32  -72.39,104.14 0 top  (outside the outline)
R33  -77.47,104.14 0 top  (outside the outline)
R34  -82.55,104.14 0 top  (outside the outline)
R35  -87.63,104.14 0 top  (outside the outline)
R36  -92.71,104.14 0 top  (outside the outline)
R37  -97.79,104.14 0 top  (outside the outline)
R38  -102.87,104.14 0 top  (outside the outline)
R39  -105.41,107.95 0 top  (outside the outline)
R40  -110.49,107.95 0 top  (outside the outline)
R41  -15.24,113.03 0 top  (outside the outline)
R42  -20.32,113.03 0 top  (outside the outline)
RBH1  -73.66,113.03 0 top  (outside the outline)
RBH2  -80.01,113.03 0 top  (outside the outline)
RBH3  -86.36,113.03 0 top  (outside the outline)
RBH4  -92.71,113.03 0 top  (outside the outline)
RBH5  -99.06,113.03 0 top  (outside the outline)
RBH6  -105.41,113.03 0 top  (outside the outline)
RBH7  -111.76,113.03 0 top  (outside the outline)
RBH8  -17.78,118.11 0 top  (outside the outline)
RBH9  -24.13,118.11 0 top  (outside the outline)
RBH10  -29.21,113.03 0 top  (outside the outline)
RBH11  -36.83,113.03 0 top  (outside the outline)
RBH12  -44.45,113.03 0 top  (outside the outline)
RBL1  -30.48,118.11 0 top  (outside the outline)
RBL2  -36.83,118.11 0 top  (outside the outline)
RBL3  -43.18,118.11 0 top  (outside the outline)
RBL4  -49.53,118.11 0 top  (outside the outline)
RBL5  -55.88,118.11 0 top  (outside the outline)
RBL6  -62.23,118.11 0 top  (outside the outline)
RBL7  -68.58,118.11 0 top  (outside the outline)
RBL8  -74.93,118.11 0 top  (outside the outline)
RBL9  -81.28,118.11 0 top  (outside the outline)
RBL10  -52.07,113.03 0 top  (outside the outline)
RBL11  -59.69,113.03 0 top  (outside the outline)
RBL12  -67.31,113.03 0 top  (outside the outline)
SFH615A-4  22.86,2.54 90 top
TEMP_SENSE  137.16,59.69 0 top
TS_POW  115.57,59.69 0 top
U$1  105.41,49.53 0 top
U$2  148.59,10.16 90 bottom
U$3  12.7,16.51 180 bottom
U$4  154.94,26.67 90 top
U$5  138.43,2.54 90 bottom
U$6  144.78,19.05 90 top
U$7  128.27,2.54 90 bottom
U$8  34.29,43.18 270 bottom
U$9  134.62,19.05 90 top
U$10  118.11,2.54 90 bottom
U$11  124.46,19.05 90 top
U$12  107.95,2.54 90 bottom
U$13  114.3,19.05 90 top
U$14  97.79,2.54 90 bottom
U$15  96.52,19.05 90 top
U$16  87.63,2.54 90 bottom
U$17  83.82,19.05 270 top
U$18  77.47,2.54 90 bottom
U$19  -81.28,78.74 0 top  (outside the outline)
U$20  67.31,2.54 90 bottom
U$21  -90.17,78.74 0 top  (outside the outline)
U$22  57.15,2.54 90 bottom
U$23  -99.06,78.74 0 top  (outside the outline)
U$24  46.99,2.54 90 bottom
U$25  -107.95,78.74 0 top  (outside the outline)
U$26  36.83,2.54 90 bottom
U$27  107.95,19.05 90 top
X1  15.24,58.42 180 top

### Tracks (layer width: path | path; a pad name or v marks a point on that pad's centre or on a via)
3V3  (7 unrouted)
5V  (4 unrouted)
AGND  (21 unrouted)
B1  (7 unrouted)
B2  (6 unrouted)
B3  (6 unrouted)
B4  (6 unrouted)
B5  (6 unrouted)
B6  (6 unrouted)
B7  (6 unrouted)
B8  (6 unrouted)
B9  (6 unrouted)
B10  (6 unrouted)
B11  (6 unrouted)
B12  (1 unrouted)
BGND  (1 unrouted)
BT1  (1 unrouted)
C1  (1 unrouted)
C2  (1 unrouted)
C3  (1 unrouted)
C4  (1 unrouted)
C5  (1 unrouted)
C6  (1 unrouted)
C7  (1 unrouted)
C8  (1 unrouted)
C9  (1 unrouted)
C10  (1 unrouted)
C11  (1 unrouted)
C12  (1 unrouted)
CAN_HIGH  (1 unrouted)
CAN_LOW  (1 unrouted)
CHARGE+  (12 unrouted)
CHARGE-  (12 unrouted)
FAULT_ACTIVE_LOW  (2 unrouted)
GLV_3V3  (1 unrouted)
GLV_5V  (3 unrouted)
GLV_12V  (5 unrouted)
GLV_FAULT  (via drill 1.27 pad 3.81)  (2 unrouted)
  other vias: 3.81,17.78
GLV_GND  (8 unrouted)
GND  (6 unrouted)
N$1  (2 unrouted)
N$2  (1 unrouted)
N$3  (1 unrouted)
N$4  (1 unrouted)
N$5  (2 unrouted)
N$6  (1 unrouted)
N$7  (1 unrouted)
N$8  (1 unrouted)
N$9  (1 unrouted)
N$10  (2 unrouted)
N$11  (1 unrouted)
N$12  (2 unrouted)
N$13  (1 unrouted)
N$14  (2 unrouted)
N$15  (1 unrouted)
N$16  (2 unrouted)
N$17  (1 unrouted)
N$18  (2 unrouted)
N$19  (1 unrouted)
N$20  (2 unrouted)
N$21  (1 unrouted)
N$22  (2 unrouted)
N$23  (1 unrouted)
N$24  (2 unrouted)
N$25  (1 unrouted)
N$26  (2 unrouted)
N$27  (1 unrouted)
N$28  (2 unrouted)
N$29  (1 unrouted)
N$30  (1 unrouted)
N$31  (1 unrouted)
N$32  (1 unrouted)
N$33  (1 unrouted)
N$34  (1 unrouted)
N$35  (1 unrouted)
N$36  (1 unrouted)
N$37  (1 unrouted)
N$38  (1 unrouted)
N$39  (1 unrouted)
N$40  (1 unrouted)
N$41  (1 unrouted)
N$42  (via drill 3.3 pad 6.35)
  other vias: 3.81,3.81
N$43  (via drill 3.3 pad 6.35)
  other vias: 161.29,3.81
N$44  (via drill 3.3 pad 6.35)
  other vias: 161.29,59.69
N$45  (via drill 3.3 pad 6.35)
  other vias: 3.81,59.69
N$47  (1 unrouted)
SCL  (2 unrouted)
SCL_GLV  (1 unrouted)
SDA  (2 unrouted)
SDA_GLV  (1 unrouted)
TS1  (1 unrouted)
TS2  (1 unrouted)
TS3  (1 unrouted)
TS4  (1 unrouted)
TS5  (1 unrouted)
TS6  (1 unrouted)
TS7  (1 unrouted)
TS8  (1 unrouted)
TS9  (1 unrouted)
TS10  (1 unrouted)
TS11  (1 unrouted)
TS12  (1 unrouted)
VS1  (2 unrouted)
VS2  (2 unrouted)
VS3  (2 unrouted)
VS4  (2 unrouted)
VS5  (2 unrouted)
VS6  (2 unrouted)
VS7  (2 unrouted)
VS8  (2 unrouted)
VS9  (2 unrouted)
VS10  (2 unrouted)
VS11  (2 unrouted)
VS12  (2 unrouted)